# EAGLE schematic Shruthi-Sidekick-v01 (EAGLE 5.09)
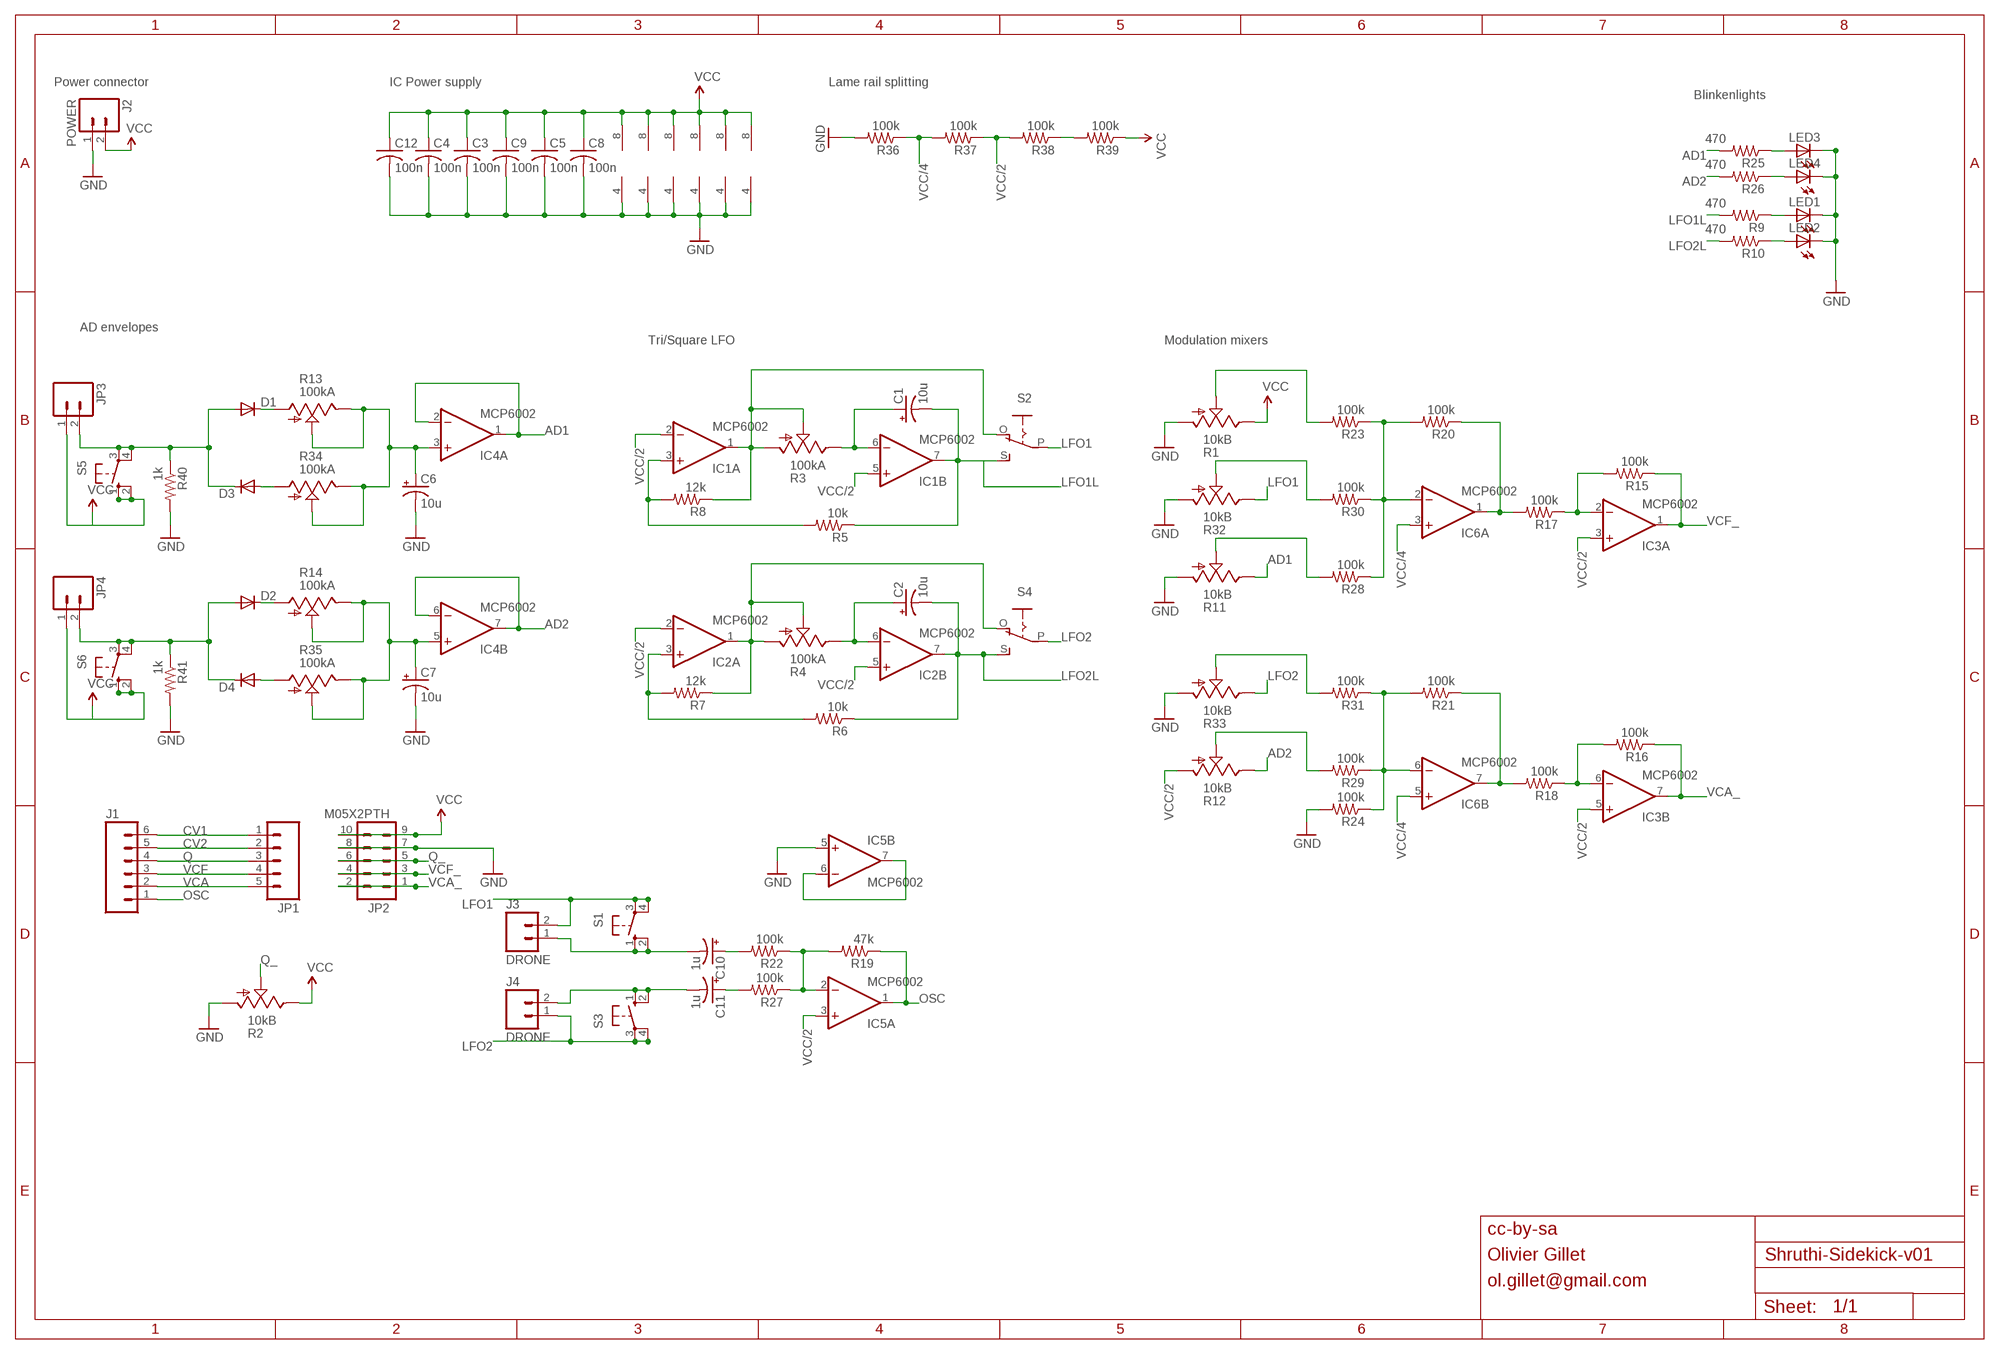
[diagram p0: schematic, sheet 1]

## Parts
C1  10u  CPOL-USE2.5-6  [E2,5-6]
C2  10u  CPOL-USE2.5-6  [E2,5-6]
C3  100n  C-US025-024X044  [C025-024X044]
C4  100n  C-US025-024X044  [C025-024X044]
C5  100n  C-US025-024X044  [C025-024X044]
C6  10u  CPOL-USE2.5-6  [E2,5-6]
C7  10u  CPOL-USE2.5-6  [E2,5-6]
C8  100n  C-US025-024X044  [C025-024X044]
C9  100n  C-US025-024X044  [C025-024X044]
C10  1u  CPOL-USE2.5-6  [E2,5-6]
C11  1u  CPOL-USE2.5-6  [E2,5-6]
C12  100n  C-US025-024X044  [C025-024X044]
D1  DIODE-D-5  [D-5]
D2  DIODE-D-5  [D-5]
D3  DIODE-D-5  [D-5]
D4  DIODE-D-5  [D-5]
IC1  MCP6002  TL082P  [DIL08]
IC2  MCP6002  TL082P  [DIL08]
IC3  MCP6002  TL082P  [DIL08]
IC4  MCP6002  TL082P  [DIL08]
IC5  MCP6002  TL082P  [DIL08]
IC6  MCP6002  TL082P  [DIL08]
J1  M06SIP  [1X06]
J2  POWER  M02PTH  [1X02]
J3  DRONE  M02PTH  [1X02]
J4  DRONE  M02PTH  [1X02]
JP1  M05PTH  [1X05]
JP2  M05X2PTH  [AVR_ICSP]
JP3  M02  [1X02_LONGPADS]
JP4  M02  [1X02_LONGPADS]
LED1  LED3MM  [LED3MM]
LED2  LED3MM  [LED3MM]
LED3  LED3MM  [LED3MM]
LED4  LED3MM  [LED3MM]
R1  10kB  POT_US  [ALPS_POT_SFE]
R2  10kB  POT_US  [ALPS_POT_SFE]
R3  100kA  POT_US  [ALPS_POT_SFE]
R4  100kA  POT_US  [ALPS_POT_SFE]
R5  10k  R-US_0204/7  [0204/7]
R6  10k  R-US_0204/7  [0204/7]
R7  12k  R-US_0204/7  [0204/7]
R8  12k  R-US_0204/7  [0204/7]
R9  470  R-US_0204/7  [0204/7]
R10  470  R-US_0204/7  [0204/7]
R11  10kB  POT_US  [ALPS_POT_SFE]
R12  10kB  POT_US  [ALPS_POT_SFE]
R13  100kA  POT_US  [ALPS_POT_SFE]
R14  100kA  POT_US  [ALPS_POT_SFE]
R15  100k  R-US_0204/7  [0204/7]
R16  100k  R-US_0204/7  [0204/7]
R17  100k  R-US_0204/7  [0204/7]
R18  100k  R-US_0204/7  [0204/7]
R19  47k  R-US_0204/7  [0204/7]
R20  100k  R-US_0204/7  [0204/7]
R21  100k  R-US_0204/7  [0204/7]
R22  100k  R-US_0204/7  [0204/7]
R23  100k  R-US_0204/7  [0204/7]
R24  100k  R-US_0204/7  [0204/7]
R25  470  R-US_0204/7  [0204/7]
R26  470  R-US_0204/7  [0204/7]
R27  100k  R-US_0204/7  [0204/7]
R28  100k  R-US_0204/7  [0204/7]
R29  100k  R-US_0204/7  [0204/7]
R30  100k  R-US_0204/7  [0204/7]
R31  100k  R-US_0204/7  [0204/7]
R32  10kB  POT_US  [ALPS_POT_SFE]
R33  10kB  POT_US  [ALPS_POT_SFE]
R34  100kA  POT_US  [ALPS_POT_SFE]
R35  100kA  POT_US  [ALPS_POT_SFE]
R36  100k  R-US_0204/7  [0204/7]
R37  100k  R-US_0204/7  [0204/7]
R38  100k  R-US_0204/7  [0204/7]
R39  100k  R-US_0204/7  [0204/7]
R40  1k  R-US_0204/7  [0204/7]
R41  1k  R-US_0204/7  [0204/7]
S1  40-XX  [B3F-40XX]
S2  EG1218S  [EG1218]
S3  40-XX  [B3F-40XX]
S4  EG1218S  [EG1218]
S5  40-XX  [B3F-40XX]
S6  40-XX  [B3F-40XX]

## Nets
AD1: IC4.1(A:OUT) IC4.2(A:-IN) R11.P$1(E) R25.2
AD2: IC4.6(B:-IN) IC4.7(B:OUT) R12.P$1(E) R26.2
CV1: J1.6 JP1.1
CV2: J1.5 JP1.2
GND: C3.2 C4.2 C5.2 C6.- C7.- C8.2 C9.2 C12.2 IC1.4(P:V-) IC2.4(P:V-) IC3.4(P:V-) IC4.4(P:V-) IC5.4(P:V-) IC5.5(B:+IN) IC6.4(P:V-) J2.1 JP2.7 JP2.8 LED1.K(C) LED2.K(C) LED3.K(C) LED4.K(C) R1.P$3(A) R2.P$3(A) R11.P$3(A) R24.2 R32.P$3(A) R33.P$3(A) R36.2 R40.2 R41.2
LFO1: J3.2 R32.P$1(E) S1.3(P) S1.4(P1) S2.P
LFO1L: C1.- IC1.7(B:OUT) R5.1 R9.2 S2.S
LFO2: J4.1 R33.P$1(E) S3.3(P) S3.4(P1) S4.P
LFO2L: C2.- IC2.7(B:OUT) R6.1 R10.2 S4.S
N$1: C11.- J4.2 S3.1(S) S3.2(S1)
N$2: D1.C R13.P$3(A)
N$3: D3.A R34.P$3(A)
N$4: R30.2 R32.P$2(S)
N$5: D2.C R14.P$3(A)
N$6: D4.A R35.P$3(A)
N$7: C6.+ IC4.3(A:+IN) R13.P$1(E) R13.P$2(S) R34.P$1(E) R34.P$2(S)
N$8: C7.+ IC4.5(B:+IN) R14.P$1(E) R14.P$2(S) R35.P$1(E) R35.P$2(S)
N$9: IC6.2(A:-IN) R20.2 R23.1 R28.1 R30.1
N$10: D1.A D3.C JP3.2 R40.1 S5.3(P) S5.4(P1)
N$11: D2.A D4.C JP4.2 R41.1 S6.3(P) S6.4(P1)
N$13: LED3.A R25.1
N$14: LED4.A R26.1
N$15: R1.P$2(S) R23.2
N$16: R11.P$2(S) R28.2
N$17: IC6.1(A:OUT) R17.2 R20.1
N$18: IC3.2(A:-IN) R15.2 R17.1
N$19: IC6.6(B:-IN) R21.2 R24.1 R29.1 R31.1
N$20: R31.2 R33.P$2(S)
N$21: R12.P$2(S) R29.2
N$22: IC1.3(A:+IN) R5.2 R8.2
N$23: IC6.7(B:OUT) R18.2 R21.1
N$24: IC3.6(B:-IN) R16.2 R18.1
N$25: IC1.1(A:OUT) R3.P$2(S) R3.P$3(A) R8.1 S2.O
N$26: IC2.3(A:+IN) R6.2 R7.2
N$27: C1.+ IC1.6(B:-IN) R3.P$1(E)
N$29: IC2.1(A:OUT) R4.P$2(S) R4.P$3(A) R7.1 S4.O
N$30: C2.+ IC2.6(B:-IN) R4.P$1(E)
N$32: IC5.2(A:-IN) R19.2 R22.1 R27.1
N$33: IC5.6(B:-IN) IC5.7(B:OUT)
N$34: LED1.A R9.1
N$35: R38.1 R39.2
N$36: LED2.A R10.1
N$43: C11.+ R27.2
N$44: C10.+ R22.2
N$46: C10.- J3.1 S1.1(S) S1.2(S1)
OSC: IC5.1(A:OUT) J1.1 R19.1
Q: J1.4 JP1.3
Q_: JP2.5 JP2.6 R2.P$2(S)
VCA: J1.2 JP1.5
VCA_: IC3.7(B:OUT) JP2.1 JP2.2 R16.1
VCC: C3.1 C4.1 C5.1 C8.1 C9.1 C12.1 IC1.8(P:V+) IC2.8(P:V+) IC3.8(P:V+) IC4.8(P:V+) IC5.8(P:V+) IC6.8(P:V+) J2.2 JP2.9 JP2.10 JP3.1 JP4.1 R1.P$1(E) R2.P$1(E) R39.1 S5.1(S) S5.2(S1) S6.1(S) S6.2(S1)
VCC/2: IC1.2(A:-IN) IC1.5(B:+IN) IC2.2(A:-IN) IC2.5(B:+IN) IC3.3(A:+IN) IC3.5(B:+IN) IC5.3(A:+IN) R12.P$3(A) R37.1 R38.2
VCC/4: IC6.3(A:+IN) IC6.5(B:+IN) R36.1 R37.2
VCF: J1.3 JP1.4
VCF_: IC3.1(A:OUT) JP2.3 JP2.4 R15.1

## Notes on the sheet
- Power connector | IC Power supply | Lame rail splitting
- Blinkenlights
- AD envelopes
- Tri/Square LFO | Modulation mixers
- cc-by-sa
- Olivier Gillet
- ol.gillet@gmail.com

## Library data of the parts
C1 C2 C6 C7 C10 C11 = rcl:CPOL-US: POLARIZED CAPACITOR, American symbol
C3-C5 C8 C9 C12 = rcl:C-US: CAPACITOR, American symbol
D1-D4 = diode:DIODE-: DIODE
IC1-IC6 = gm-ics:TL082: OP AMP
J1 = SparkFun:M06: Header 6 Standard 6-pin 0.1" header. Use with straight break away headers (SKU : PRT-00116), right angle break away headers (PRT-00553), swiss pins (PRT-00743), machine pins (PRT-00117), and female headers (PRT-00115). Molex polarized connector foot print use with SKU : PRT-08094 with associated crimp pins and housings. NOTES ON THE VARIANTS LOCK and LOCK_LONGPADS... This footprint was designed to help hold the alignment of a through-hole component (i.e. 6-pin header) while soldering it into place. You may notice that each hole has been shifted either up or down by 0.005 of an inch from it's more standard position (which is a perfectly straight line). This slight alteration caused the pins (the squares in the middle) to touch the edges of the holes. Because they are alternating, it causes a "brace" to hold the component in place. 0.005 has proven to be the perfect amount of "off-center" position when using our standard breakaway headers. Although looks a little odd when you look at the bare footprint, once you have a header in there, the alteration is very hard to notice. Also, if you push a header all the way into place, it is covered up entirely on the bottom side. This idea of altering the position of holes to aid alignment will be further integrated into the Sparkfun Library for other footprints. It can help hold any component with 3 or more connection pins.
J2-J4 JP3 JP4 = SparkFun:M02: Header 2 Standard 2-pin 0.1" header. Use with straight break away headers (SKU : PRT-00116), right angle break away headers (PRT-00553), swiss pins (PRT-00743), machine pins (PRT-00117), and female headers (PRT-00115). Molex polarized connector foot print use with SKU : PRT-08233 with associated crimp pins and housings.
JP1 = SparkFun:M05: Header 5 Standard 5-pin 0.1" header. Use with straight break away headers (SKU : PRT-00116), right angle break away headers (PRT-00553), swiss pins (PRT-00743), machine pins (PRT-00117), and female headers (PRT-00115). Molex polarized connector foot print use with SKU : PRT-08230 with associated crimp pins and housings.
JP2 = SparkFun:M05X2: Header 5x2 Standard 10-pin dual row 0.1" header. Commonly used with AVR-ISP. Use with Spark Fun Electronics SKU: PRT-00778
LED1-LED4 = led:LED: LED OSRAM: - CHIPLED LG R971, LG N971, LY N971, LG Q971, LY Q971, LO R971, LY R971 LH N974, LH R974 LS Q976, LO Q976, LY Q976 LO Q996 - Hyper CHIPLED LW Q18S LB Q993, LB Q99A, LB R99A - SideLED LS A670, LO A670, LY A670, LG A670, LP A670 LB A673, LV A673, LT A673, LW A673 LH A674 LY A675 LS A676, LA A676, LO A676, LY A676, LW A676 LS A679, LY A679, LG A679 - Hyper Micro SIDELED® LS Y876, LA Y876, LO Y876, LY Y876 LT Y87S - SmartLED LW L88C, LW L88S LB L89C, LB L89S, LG L890 LS L89K, LO L89K, LY L89K LS L896, LA L896, LO L896, LY L896 - TOPLED LS T670, LO T670, LY T670, LG T670, LP T670 LSG T670, LSP T670, LSY T670, LOP T670, LYG T670 LG T671, LOG T671, LSG T671 LB T673, LV T673, LT T673, LW T673 LH T674 LS T676, LA T676, LO T676, LY T676, LB T676, LH T676, LSB T676, LW T676 LB T67C, LV T67C, LT T67C, LS T67K, LO T67K, LY T67K, LW E67C LS E67B, LA E67B, LO E67B, LY E67B, LB E67C, LV E67C, LT E67C LW T67C LS T679, LY T679, LG T679 LS T770, LO T770, LY T770, LG T770, LP T770 LB T773, LV T773, LT T773, LW T773 LH T774 LS E675, LA E675, LY E675, LS T675 LS T776, LA T776, LO T776, LY T776, LB T776 LHGB T686 LT T68C, LB T68C - Hyper Mini TOPLED® LB M676 - Mini TOPLED Santana® LG M470 LS M47K, LO M47K, LY M47K Source: http://www.osram.convergy.de LUXEON: - LUMILED® LXK2-PW12-R00, LXK2-PW12-S00, LXK2-PW14-U00, LXK2-PW14-V00 LXK2-PM12-R00, LXK2-PM12-S00, LXK2-PM14-U00 LXK2-PE12-Q00, LXK2-PE12-R00, LXK2-PE12-S00, LXK2-PE14-T00, LXK2-PE14-U00 LXK2-PB12-K00, LXK2-PB12-L00, LXK2-PB12-M00, LXK2-PB14-N00, LXK2-PB14-P00, LXK2-PB14-Q00 LXK2-PR12-L00, LXK2-PR12-M00, LXK2-PR14-Q00, LXK2-PR14-R00 LXK2-PD12-Q00, LXK2-PD12-R00, LXK2-PD12-S00 LXK2-PH12-R00, LXK2-PH12-S00 LXK2-PL12-P00, LXK2-PL12-Q00, LXK2-PL12-R00 Source: www.luxeon.com KINGBRIGHT: KA-3528ASYC Source: www.kingbright.com
R1-R4 R11-R14 R32-R35 = pot-alps:POT_US
R5-R10 R15-R31 R36-R41 = rcl:R-US_: RESISTOR, American symbol
S1 S3 S5 S6 = og-switch:40-XX: OMRON SWITCH
S2 S4 = adafruit:EG1218: SLIDING SWITCH 0.1" spacing through hole, vertical SPDT slide switch http://www.ladyada.net/library/pcb/eaglelibrary.html